# Altium schematic sheet converter.SchDoc
size 420 x 297 mm; Address1: Address1; Address2: Address2; Address3: Address3; Address4: Address4; DocumentNumber: АБВГ.123456.001 Э3; SheetNumber: 1; SheetTotal: 3; Scale: 1:1; DocumentType: Схема электрическая принципиальная; FirstReferrence: АБВГ.123456.001
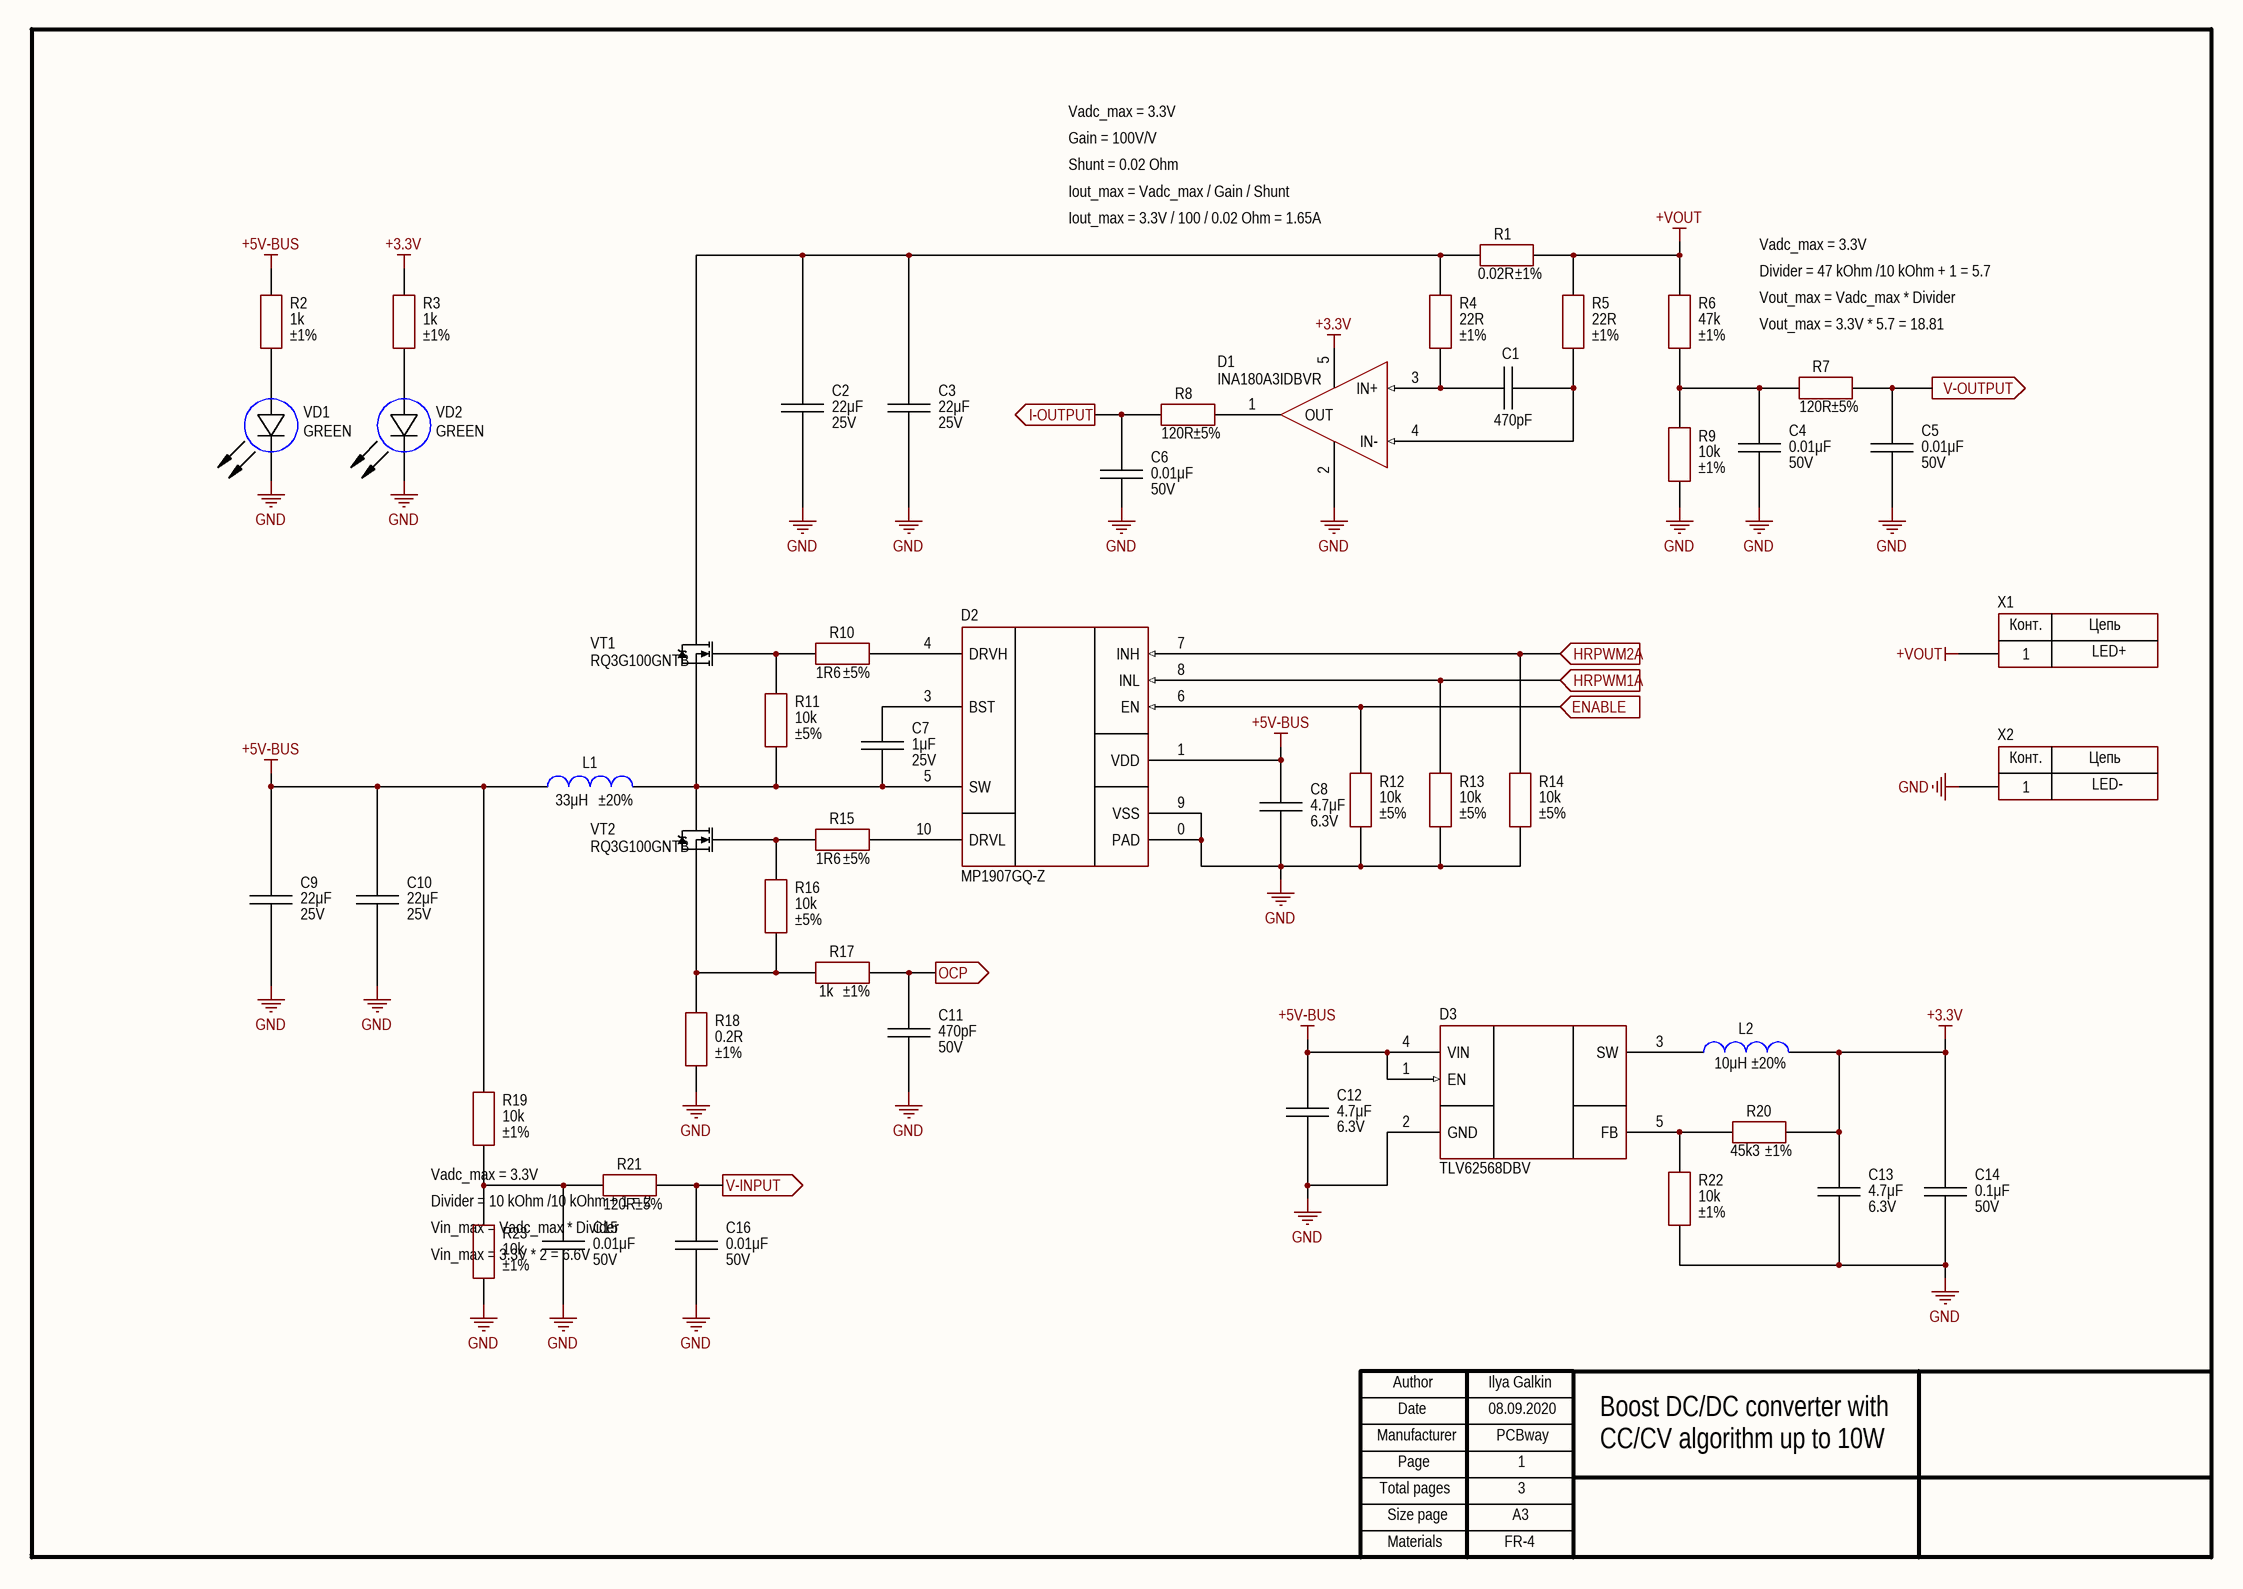
[diagram p0: converter.SchDoc]

## Parts
C1  value 470pF  [CAP: 0603]
C2  value 22μF  Voltage: 25V  [CAP: 1210]
C3  value 22μF  Voltage: 25V  [CAP: 1210]
C4  value 0.01μF  Voltage: 50V  [CAP: 0603]
C5  value 0.01μF  Voltage: 50V  [CAP: 0603]
C6  value 0.01μF  Voltage: 50V  [CAP: 0603]
C7  value 1μF  Voltage: 25V  [CAP: 0603]
C8  value 4.7μF  Voltage: 6.3V  [CAP: 0603]
C9  value 22μF  Voltage: 25V  [CAP: 1210]
C10  value 22μF  Voltage: 25V  [CAP: 1210]
C11  value 470pF  Voltage: 50V  [CAP: 0603]
C12  value 4.7μF  Voltage: 6.3V  [CAP: 0603]
C13  value 4.7μF  Voltage: 6.3V  [CAP: 0603]
C14  value 0.1μF  Voltage: 50V  [CAP: 0603]
C15  value 0.01μF  Voltage: 50V  [CAP: 0603]
C16  value 0.01μF  Voltage: 50V  [CAP: 0603]
D1  (no value)  [SOT23-5]
D2  (no value)  [10-DFN]
D3  (no value)  [SOT23-5]
L1  value 33μH  Tolerance: ±20%  [IND: SRP1038C]
L2  value 10μH  Tolerance: ±20%  [IND: CD32]
R1  value 0.02R  Tolerance: ±1%  [RES: 1206]
R2  value 1k  Tolerance: ±1%  [RES: 0603]
R3  value 1k  Tolerance: ±1%  [RES: 0603]
R4  value 22R  Tolerance: ±1%  [RES: 0603]
R5  value 22R  Tolerance: ±1%  [RES: 0603]
R6  value 47k  Tolerance: ±1%  [RES: 0603]
R7  value 120R  Tolerance: ±5%  [RES: 0603]
R8  value 120R  Tolerance: ±5%  [RES: 0603]
R9  value 10k  Tolerance: ±1%  [RES: 0603]
R10  value 1R6  Tolerance: ±5%  [RES: 0603]
R11  value 10k  Tolerance: ±5%  [RES: 0603]
R12  value 10k  Tolerance: ±5%  [RES: 0603]
R13  value 10k  Tolerance: ±5%  [RES: 0603]
R14  value 10k  Tolerance: ±5%  [RES: 0603]
R15  value 1R6  Tolerance: ±5%  [RES: 0603]
R16  value 10k  Tolerance: ±5%  [RES: 0603]
R17  value 1k  Tolerance: ±1%  [RES: 0603]
R18  value 0.2R  Tolerance: ±1%  [RES: 1210]
R19  value 10k  Tolerance: ±1%  [RES: 0603]
R20  value 45k3  Tolerance: ±1%  [RES: 0603]
R21  value 120R  Tolerance: ±5%  [RES: 0603]
R22  value 10k  Tolerance: ±1%  [RES: 0603]
R23  value 10k  Tolerance: ±1%  [RES: 0603]
VD1  Color: GREEN  [LED: 0603G]
VD2  Color: GREEN  [LED: 0603G]
VT1  PartNumber: RQ3G100GNTB  [8-PowerWDFN]
VT2  PartNumber: RQ3G100GNTB  [8-PowerWDFN]
X1  (no value)  [CON: TH 1mm]
X2  (no value)  [CON: TH 1mm]

## Ports
ENABLE (in), HRPWM1A (in), HRPWM2A (in), I-OUTPUT (out), OCP (out), V-INPUT (out), V-OUTPUT (out)

## Nets
+3.3V: C13.2 C14.2 D1.5(V+) L2.1 R3.2 R20.1
+5V-BUS: C8.2 C9.2 C10.2 C12.2 D2.1(VDD) D3.1(EN) D3.4(VIN) L1.2 R2.2 R19.2
+VOUT: R1.2 R5.2 R6.1 X1.1
GND: C2.1 C3.1 C4.1 C5.1 C6.1 C8.1 C9.1 C10.1 C11.2 C12.1 C13.1 C14.1 C15.1 C16.1 D1.2(V-) D2.0(PAD) D2.9(VSS) D3.2(GND) R9.1 R12.1 R13.1 R14.1 R18.1 R22.1 R23.1 VD1.2(C) VD2.2(C) X2.1
ENABLE: D2.6(EN) R12.2 ; port ENABLE
HRPWM1A: D2.8(INL) R13.2 ; port HRPWM1A
HRPWM2A: D2.7(INH) R14.2 ; port HRPWM2A
I-OUTPUT: C6.2 R8.1 ; port I-OUTPUT
OCP: C11.1 R17.2 ; port OCP
V-INPUT: C16.2 R21.2 ; port V-INPUT
V-OUTPUT: C5.2 R7.2 ; port V-OUTPUT
NetC1_1: C1.1 D1.4(IN-) R5.1
NetC1_2: C1.2 D1.3(IN+) R4.1
NetC2_2: C2.2 C3.2 R1.1 R4.2 VT1.2(D)
NetC4_2: C4.2 R6.2 R7.1 R9.2
NetC7_1: C7.1 D2.5(SW) L1.1 R11.1 VT1.3(S) VT2.2(D)
NetC7_2: C7.2 D2.3(BST)
NetC15_2: C15.2 R19.1 R21.1 R23.2
NetD1_1: D1.1(OUT) R8.2
NetD2_4: D2.4(DRVH) R10.2
NetD2_10: D2.10(DRVL) R15.2
NetD3_3: D3.3(SW) L2.2
NetD3_5: D3.5(FB) R20.2 R22.2
NetR2_1: R2.1 VD1.1(A)
NetR3_1: R3.1 VD2.1(A)
NetR10_1: R10.1 R11.2 VT1.1(G)
NetR15_1: R15.1 R16.2 VT2.1(G)
NetR16_1: R16.1 R17.1 R18.2 VT2.3(S)

## Notes on the sheet
- Vadc_max = 3.3V
- Gain = 100V/V
- Shunt = 0.02 Ohm
- Iout_max = Vadc_max / Gain / Shunt
- Iout_max = 3.3V / 100 / 0.02 Ohm = 1.65A
- Divider = 47 kOhm /10 kOhm + 1 = 5.7
- Vout_max = Vadc_max * Divider
- Vout_max = 3.3V * 5.7 = 18.81
- LED+
- LED-
- Divider = 10 kOhm /10 kOhm + 1 = 2
- (near R23) Vin_max = Vadc_max * Divider
- (near R23) Vin_max = 3.3V * 2 = 6.6V
- Ilya Galkin
- 08.09.2020
- PCBway
- 1
- Boost DC/DC converter with
- CC/CV algorithm up to 10W
- 3
- FR-4
- Author
- Manufacturer
- Date
- Page
- Total pages
- Size page
- A3
- Materials
- (in symbol Connector_single_power) Конт.; Цепь

## Library data of the parts
C1 = Ceramic_0603: Manufacturer: Yageo; PartNumber: CL10C471JB8NNNC; ValueManufacturerPartNumber: Ceramic capacitor, 470pF, NPO, ±5%, 50V, 0603, -55...+125°C; TypeCapacitor: Ceramic capacitor; Tolerance: ±5%; TypeDielectric: NPO; Voltage: 50V; Package: 0603; HelpURL: https://www.digikey.com/product-detail/en/samsung-electro-mechanics/CL10C471JB8NNNC/1276-1168-1-ND/3889254; Temperature: -55...+125°C
C2 C3 C9 C10 = Ceramic_1210: Manufacturer: Samsung; PartNumber: CL32B226KAJNNNE; ValueManufacturerPartNumber: Ceramic capacitor, 22μF, X7R, ±10%, 25V, 1210, -55...+125°C; TypeCapacitor: Ceramic capacitor; Tolerance: ±10%; TypeDielectric: X7R; Package: 1210; HelpURL: https://www.digikey.com/product-detail/en/samsung-electro-mechanics/CL32B226KAJNNNE/1276-3392-1-ND/3891478; Temperature: -55...+125°C
C4-C6 C15 C16 = Ceramic_0603: Manufacturer: Samsung; PartNumber: CL10B103KB8NNNC; ValueManufacturerPartNumber: Ceramic capacitor, 0.01μF, X7R, ±10%, 50V, 0603, -55...+125°C; TypeCapacitor: Ceramic capacitor; Tolerance: ±10%; TypeDielectric: X7R; Package: 0603; HelpURL: https://www.digikey.com/product-detail/en/samsung-electro-mechanics/CL10B103KB8NNNC/1276-1009-1-ND/3889095; Temperature: -55...+125°C
C7 = Ceramic_0603: Manufacturer: Samsung; PartNumber: CL10B105KA8NNNC; ValueManufacturerPartNumber: Ceramic capacitor, 1μF, X7R, ±10%, 25V, 0603, -55...+125°C; TypeCapacitor: Ceramic capacitor; Tolerance: ±10%; TypeDielectric: X7R; Package: 0603; HelpURL: https://www.digikey.com/product-detail/en/samsung-electro-mechanics/CL10B105KA8NNNC/1276-1184-1-ND/3889270; Temperature: -55...+125°C
C8 C12 C13 = Ceramic_0603: Manufacturer: Samsung; PartNumber: CL10B475KQ8NQNC; ValueManufacturerPartNumber: Ceramic capacitor, 4.7μF, X7R, ±10%, 6.3V, 0603, -55...+125°C; TypeCapacitor: Ceramic capacitor; Tolerance: ±10%; TypeDielectric: X7R; Package: 0603; HelpURL: https://www.digikey.com/product-detail/en/samsung-electro-mechanics/CL10B475KQ8NQNC/1276-2087-6-ND/3892601; Temperature: -55...+125°C
C11 = Ceramic_0603: Manufacturer: Yageo; PartNumber: CL10C471JB8NNNC; ValueManufacturerPartNumber: Ceramic capacitor, 470pF, NPO, ±5%, 50V, 0603, -55...+125°C; TypeCapacitor: Ceramic capacitor; Tolerance: ±5%; TypeDielectric: NPO; Package: 0603; HelpURL: https://www.digikey.com/product-detail/en/samsung-electro-mechanics/CL10C471JB8NNNC/1276-1168-1-ND/3889254; Temperature: -55...+125°C
C14 = Ceramic_0603: Manufacturer: Samsung; PartNumber: CL10B104KB8NNNL; ValueManufacturerPartNumber: Ceramic capacitor, 0.1μF, X7R, ±10%, 50V, 0603, -55...+125°C; TypeCapacitor: Ceramic capacitor; Tolerance: ±10%; TypeDielectric: X7R; Package: 0603; HelpURL: https://www.digikey.com/product-detail/en/samsung-electro-mechanics/CL10B104KB8NNNL/1276-CL10B104KB8NNNLCT-ND/10320686; Temperature: -55...+125°C
D1 = INA180A3IDBVR: Current monitor; Manufacturer: Texas Instruments; ValueManufacturerPartNumber: IC current monitor, ±1.5%, 100V/V, -0.3...+26V, -40...+125°C, SOT23-5; Supply: -0.3...+26V; Accuracy: ±1.5%; GainBandwidth: 100V/V; HelpURL: https://www.digikey.com/product-detail/en/texas-instruments/INA180A3IDBVR/296-47654-1-ND/8133023; Package: SOT23-5; ComponentType: IC current monitor; Temperature: -40...+125°C; PartNumber: INA180A3IDBVR
D2 = MP1907GQ-Z: Gate driver; Manufacturer: Monolithic Power Systems; ValueManufacturerPartNumber: Half-bridge gate driver, 100V, 500kHz, ±2.5A, supply 4.5...18V, -40...+125°C, 10-VFDFN (3x3); VoltageSupply: supply 4.5...18V; Frequency: 500kHz; CurrentOutput: ±2.5A; VoltageWork: 100V; HelpURL: https://www.digikey.com/product-detail/en/monolithic-power-systems-inc/MP1907GQ-Z/1589-1544-1-ND/9433310; Package: 10-VFDFN (3x3); ComponentType: Half-bridge gate driver; Temperature: -40...+125°C; PartNumber: MP1907GQ-Z
D3 = TLV62568DBV: Buck converter; Manufacturer: Texas Instruments; ValueManufacturerPartNumber: DC/DC buck converter, input 2.5...5.5V, 1.5MHz, output 0.6V, 1A, -40...+85°C, SOT23-5; VoltageInput: input 2.5...5.5V; Frequency: 1.5MHz; CurrentOutput: 1A; VoltageOutput: output 0.6V; HelpURL: https://www.digikey.com/product-detail/en/texas-instruments/TLV62568DBVT/296-47387-1-ND/7688580; Package: SOT23-5; ComponentType: DC/DC buck converter; Temperature: -40...+85°C; PartNumber: TLV62568DBV
L1 = Inductor_SRP1038C: Manufacturer: Bourns; PartNumber: SRP1038C-330M; ValueManufacturerPartNumber: Fixed inductor, 33μH, ±20%, SRP1038C series, 4A, -40...+125°C; TypeInductor: Fixed inductor; MaxCurrent: 4A; Package: SRP1038C series; HelpURL: https://www.digikey.com/product-detail/en/bourns-inc/SRP1038C-330M/SRP1038C-330MCT-ND/10249152; Temperature: -40...+125°C
L2 = Inductor_CD32: Manufacturer: Codaca; PartNumber: SDR0302-100ML; ValueManufacturerPartNumber: Fixed inductor, 10μH, ±20%, SP32 series, 900mA, -40...+125°C; TypeInductor: Fixed inductor; MaxCurrent: 900mA; Package: SP32 series; HelpURL: https://www.digikey.com/product-detail/en/bourns-inc/SDR0302-100ML/SDR0302-100MLCT-ND/2127048; Temperature: -40...+125°C
R1 = Resistor_1206: Manufacturer: Yageo; PartNumber: PF1206FRF070R02L; ValueManufacturerPartNumber: Resistor film, 0.02R, ±1%, 1206, 0.25W, -55...+125°C; TypeResistor: Resistor film; Power: 0.25W; Package: 1206; HelpURL: https://www.digikey.com/product-detail/en/yageo/PF1206FRF070R02L/311-0-02AJCT-ND/2178365; Temperature: -55...+125°C
R2 R3 R17 = Resistor_0603: Manufacturer: Yageo; PartNumber: RC0603FR-071KL; ValueManufacturerPartNumber: Resistor film, 1k, ±1%, 0603, 0.1W, -55...+125°C; TypeResistor: Resistor film; Power: 0.1W; Package: 0603; HelpURL: https://www.digikey.com/product-detail/en/yageo/RC0603FR-071KL/311-1-00KHRCT-ND/729790; Temperature: -55...+125°C
R4 R5 = Resistor_0603: Manufacturer: Yageo; PartNumber: RC0603FR-0722RL; ValueManufacturerPartNumber: Resistor film, 22R, ±1%, 0603, 0.1W, -55...+125°C; TypeResistor: Resistor film; Power: 0.1W; Package: 0603; HelpURL: https://www.digikey.com/product-detail/en/yageo/RC0603FR-0722RL/311-22-0HRCT-ND/730002; Temperature: -55...+125°C
R6 = Resistor_0603: Manufacturer: Yageo; PartNumber: RC0603FR-0747KL; ValueManufacturerPartNumber: Resistor film, 47k, ±1%, 0603, 0.1W, -55...+125°C; TypeResistor: Resistor film; Power: 0.1W; Package: 0603; HelpURL: https://www.digikey.com/product-detail/en/yageo/RC0603FR-0747KL/311-47-0KHRCT-ND/730200; Temperature: -55...+125°C
R7 R8 R21 = Resistor_0603: Manufacturer: Yageo; PartNumber: RC0603JR-07120RL; ValueManufacturerPartNumber: Resistor film, 120R, ±5%, 0603, 0.1W, -55...+125°C; TypeResistor: Resistor film; Power: 0.1W; Package: 0603; HelpURL: https://www.digikey.com/product-detail/en/yageo/RC0603JR-07120RL/311-120GRCT-ND/729653; Temperature: -55...+125°C
R9 R19 R22 R23 = Resistor_0603: Manufacturer: Yageo; PartNumber: RC0603FR-0710KL; ValueManufacturerPartNumber: Resistor film, 10k, ±1%, 0603, 0.1W, -55...+125°C; TypeResistor: Resistor film; Power: 0.1W; Package: 0603; HelpURL: https://www.digikey.com/product-detail/en/yageo/RC0603FR-0710KL/311-10-0KHRCT-ND/729827; Temperature: -55...+125°C
R10 R15 = Resistor_0603: Manufacturer: Yageo; PartNumber: RC0603JR-071R6L; ValueManufacturerPartNumber: Resistor film, 1R6, ±5%, 0603, 0.1W, -55...+125°C; TypeResistor: Resistor film; Power: 0.1W; Package: 0603; HelpURL: https://www.digikey.com/product-detail/en/yageo/RC0603JR-071R6L/311-1-6GRCT-ND/729638; Temperature: -55...+125°C
R11-R14 R16 = Resistor_0603: Manufacturer: Yageo; PartNumber: RC0603JR-0710KL; ValueManufacturerPartNumber: Resistor film, 10k, ±5%, 0603, 0.1W, -55...+125°C; TypeResistor: Resistor film; Power: 0.1W; Package: 0603; HelpURL: https://www.digikey.com/product-detail/en/yageo/RC0603JR-0710KL/311-10KGRCT-ND/729647; Temperature: -55...+125°C
R18 = Resistor_1210: Manufacturer: Yageo; PartNumber: RL1210FR-070R2L; ValueManufacturerPartNumber: Resistor film, 0.2R, ±1%, 1210, 0.5W, -55...+125°C; TypeResistor: Resistor film; Power: 0.5W; Package: 1210; HelpURL: https://www.digikey.com/product-detail/en/yageo/RL1210FR-070R2L/311-0-2NACT-ND/3886121; Temperature: -55...+125°C
R20 = Resistor_0603: Manufacturer: Yageo; PartNumber: RC0603FR-0745K3L; ValueManufacturerPartNumber: Resistor film, 45k3, ±1%, 0603, 0.1W, -55...+125°C; TypeResistor: Resistor film; Power: 0.1W; Package: 0603; HelpURL: https://www.digikey.com/product-detail/en/yageo/RC0603FR-0745K3L/311-45-3KHRCT-ND/730192; Temperature: -55...+125°C
VD1 VD2 = LED_single: Manufacturer: Wurth; ValueManufacturerPartNumber: LED, 20mA, 2V, 0603, -55...+150°C; PartNumber: 150060VS75000; TypeDiode: LED; Current: 20mA; VoltageDrop: 2V; Package: 0603; HelpURL: https://www.digikey.com/product-detail/en/w-rth-elektronik/150060VS75000/732-4980-1-ND/4489904; Temperature: -55...+150°C
VT1 VT2 = MOSFET_N_123: Manufacturer: Rohm Semiconductor; ValueManufacturerPartNumber: MOSFET N-channel transistor, 40V, 10A, 8.4nC, 2W, 14.3mOhm, 615pF, 8-PowerVDFN (3x3), -55...+150°C; TypeTransistor: MOSFET N-channel transistor; VoltageDS: 40V; CurrentDS: 10A; RDS: 14.3mOhm; GateCharge: 8.4nC; InputCapacitor: 615pF; MaxPower: 2W; Package: 8-PowerVDFN (3x3); HelpURL: https://www.digikey.com/product-detail/en/rohm-semiconductor/RQ3G100GNTB/RQ3G100GNTBCT-ND/5042551; Temperature: -55...+150°C
X1 X2 = Connector_single_power: ValueManufacturerPartNumber: Power connector, *, *; TypeConnector: Power connector; CommentText: "Разъем"; Manufacturer: *; HelpURL: *; PartNumber: *; VoltageMax: *; CurrentMax: *